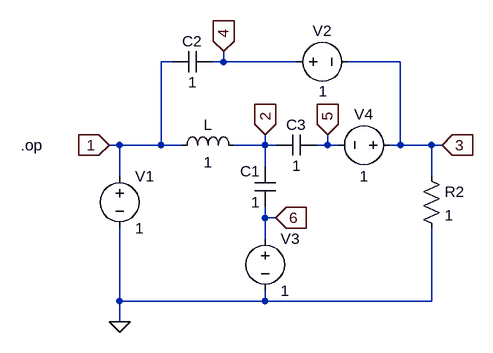
[diagram p0: schematic Bridge-T-smna.asc]
Bridge-T-smna.asc, the LTspice schematic file:
Version 4
SHEET 1 880 680
WIRE 128 -16 112 -16
WIRE 208 -16 208 -32
WIRE 208 -16 192 -16
WIRE 320 -16 208 -16
WIRE 480 -16 400 -16
WIRE 48 112 32 112
WIRE 112 112 112 -16
WIRE 112 112 48 112
WIRE 144 112 112 112
WIRE 272 112 272 96
WIRE 272 112 224 112
WIRE 288 112 272 112
WIRE 368 112 368 96
WIRE 368 112 352 112
WIRE 384 112 368 112
WIRE 480 112 480 -16
WIRE 480 112 464 112
WIRE 528 112 480 112
WIRE 544 112 528 112
WIRE 272 144 272 112
WIRE 48 160 48 112
WIRE 528 160 528 112
WIRE 272 224 272 208
WIRE 288 224 272 224
WIRE 272 256 272 224
WIRE 48 352 48 240
WIRE 272 352 272 336
WIRE 272 352 48 352
WIRE 528 352 528 240
WIRE 528 352 272 352
WIRE 48 384 48 352
FLAG 48 384 0
FLAG 32 112 1
IOPIN 32 112 In
FLAG 272 96 2
IOPIN 272 96 In
FLAG 544 112 3
IOPIN 544 112 In
FLAG 208 -32 4
IOPIN 208 -32 In
FLAG 368 96 5
IOPIN 368 96 In
FLAG 288 224 6
IOPIN 288 224 In
SYMBOL voltage 48 144 R0
WINDOW 123 0 0 Left 0
WINDOW 39 0 0 Left 0
SYMATTR InstName V1
SYMATTR Value 1
SYMBOL cap 192 -32 R90
WINDOW 0 0 32 VBottom 2
WINDOW 3 32 32 VTop 2
SYMATTR InstName C2
SYMATTR Value 1
SYMBOL cap 352 96 R90
WINDOW 0 0 32 VBottom 2
WINDOW 3 32 32 VTop 2
SYMATTR InstName C3
SYMATTR Value 1
SYMBOL cap 288 208 R180
WINDOW 0 24 56 Left 2
WINDOW 3 24 8 Left 2
SYMATTR InstName C1
SYMATTR Value 1
SYMBOL ind 128 128 R270
WINDOW 0 32 56 VTop 2
WINDOW 3 5 56 VBottom 2
SYMATTR InstName L
SYMATTR Value 1
SYMATTR SpiceLine Rser=0
SYMBOL res 512 144 R0
SYMATTR InstName R2
SYMATTR Value 1
SYMBOL voltage 304 -16 R270
WINDOW 0 32 56 VTop 2
WINDOW 3 -61 57 VTop 2
WINDOW 123 4 56 VTop 2
WINDOW 39 0 0 Left 0
SYMATTR InstName V2
SYMATTR Value 1
SYMBOL voltage 272 240 R0
WINDOW 123 0 0 Left 0
WINDOW 39 0 0 Left 0
SYMATTR InstName V3
SYMATTR Value 1
SYMBOL voltage 480 112 R90
WINDOW 0 -32 56 VBottom 2
WINDOW 3 32 56 VTop 2
WINDOW 123 0 0 Left 0
WINDOW 39 0 0 Left 0
SYMATTR InstName V4
SYMATTR Value 1
TEXT -104 112 Left 2 !.op

The netlist it stands for:
* Bridge-T-smna.asc
V1 1 0 1
C2 4 1 1
C3 5 2 1
C1 6 2 1
L 1 2 1 Rser=0
R2 3 0 1
V2 4 3 1
V3 6 0 1
V4 3 5 1
.op
.backanno
.end